# EAGLE design lfsr-display (EAGLE 8.4.3)
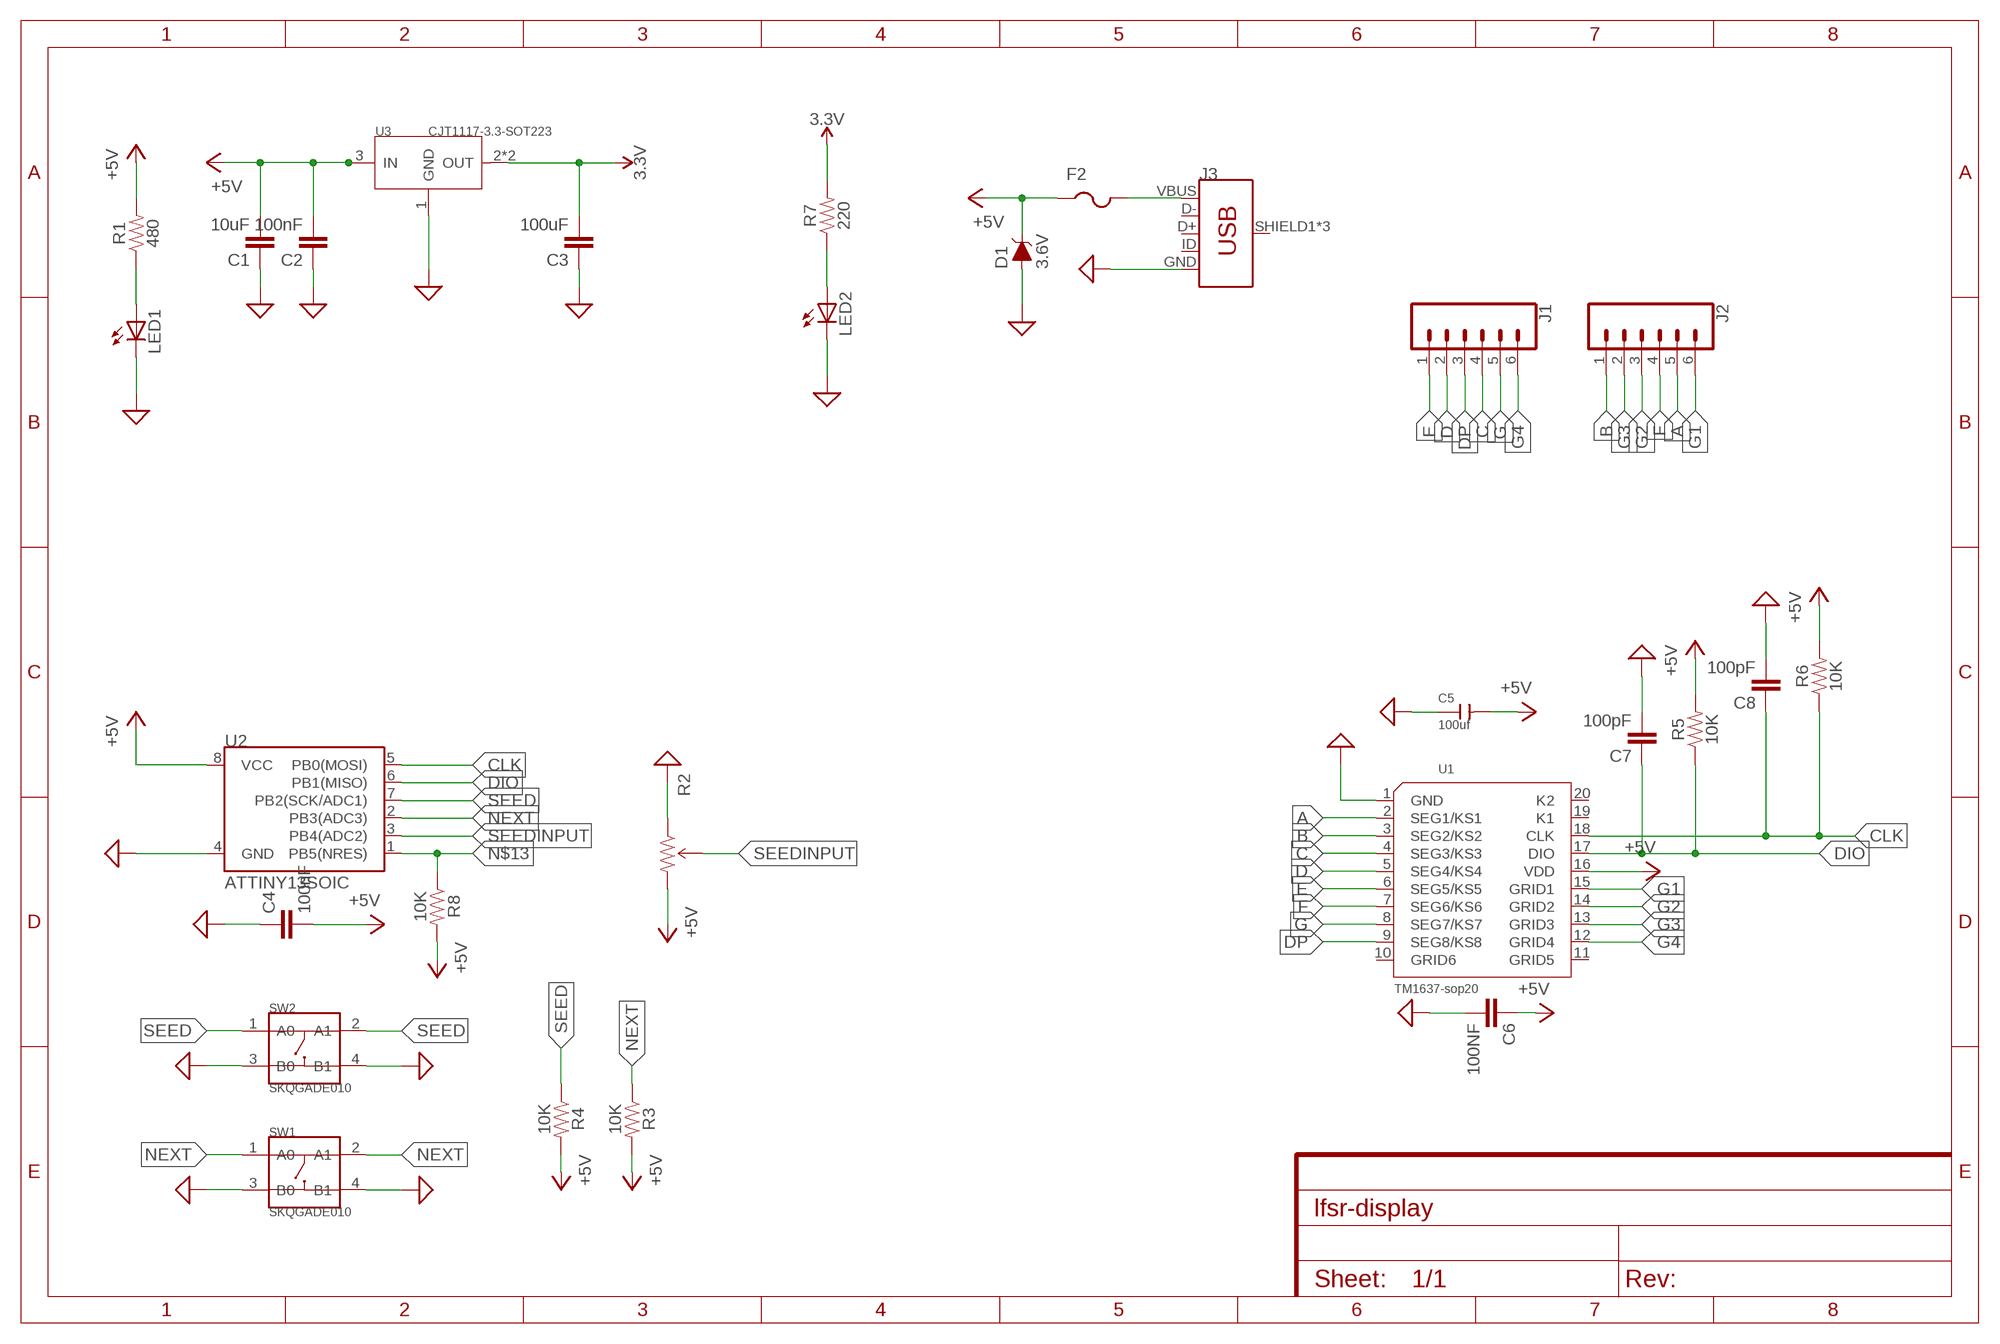
[diagram p0: schematic, sheet 1]

## Parts
C1  10uF  CAPACITOR_0603_L  [RESC0603_L]
C2  100nF  CAPACITOR_0603_L  [RESC0603_L]
C3  100uF  CAPACITOR_0603_L  [RESC0603_L]
C4  100nF  CAPACITOR_0603_L  [RESC0603_L]
C5  100uf  CERAMIC-100UF-6.3V-20%-X5R(1206)  [C1206]
C6  100NF  CAPACITOR_0603_L  [RESC0603_L]
C7  100pF  CAPACITOR_0603_L  [RESC0603_L]
C8  100pF  CAPACITOR_0603_L  [RESC0603_L]
D1  3.6V  DIODE-ZENER-BZT52C3V6S  [SOD-323]
F2  PTCFUSE-1206  [R1206]
J1  CONN_06NO_SILK_FEMALE_PTH  [1X06_NO_SILK]
J2  CONN_06NO_SILK_FEMALE_PTH  [1X06_NO_SILK]
J3  USB_MICRO-BREDUCED_PASTE  [USB-B-MICRO-SMD_RED_PASTE]
LED1  LEDCHIP-LED0603  [CHIP-LED0603]
LED2  LEDCHIP-LED0603  [CHIP-LED0603]
R1  480  0.05OHM-0603-1/5W-1%  [0603]
R2  TRIMPOT  [TRIMPOT-5MM-V2]
R3  10K  0.05OHM-0603-1/5W-1%  [0603]
R4  10K  0.05OHM-0603-1/5W-1%  [0603]
R5  10K  0.05OHM-0603-1/5W-1%  [0603]
R6  10K  0.05OHM-0603-1/5W-1%  [0603]
R7  220  0.05OHM-0603-1/5W-1%  [0603]
R8  10K  0.05OHM-0603-1/5W-1%  [0603]
SW1  SKQGADE010  SMD-BUTTON(4P-5.2X5.2X1.5MM-SKQGADE010)-SKQGADE010  [SW4-SMD-5.2X5.2X1.5MM]
SW2  SKQGADE010  SMD-BUTTON(4P-5.2X5.2X1.5MM-SKQGADE010)-SKQGADE010  [SW4-SMD-5.2X5.2X1.5MM]
U1  TM1637-sop20  DRIVER-TM1637(SOP20)  [SOP20-1.27-12.7X7.65MM]
U2  ATTINY13SOIC  [SO08_MCU]
U3  CJT1117-3.3-SOT223  PMIC-CJT1117-3.3(SOT223)  [SOT-223]

## Nets
3.3V: C3.2 R7.2 U3.2(OUT) U3.TER(OUT)
+5V: C1.2 C2.2 C4.2 C5.2 C6.1 D1.C F2.1 R1.2 R2.C(CW) R3.2 R4.2 R5.2 R6.2 R8.2 U1.16(VDD) U2.8(VCC) U3.3(IN)
A: J2.5 U1.2(SEG1/KS1)
B: J2.1 U1.3(SEG2/KS2)
C: J1.4 U1.4(SEG3/KS3)
CLK: C8.1 R6.1 U1.18(CLK) U2.5(PB0(MOSI))
D: J1.2 U1.5(SEG4/KS4)
DIO: C7.1 R5.1 U1.17(DIO) U2.6(PB1(MISO))
DP: J1.3 U1.9(SEG8/KS8)
E: J1.1 U1.6(SEG5/KS5)
F: J2.4 U1.7(SEG6/KS6)
G: J1.5 U1.8(SEG7/KS7)
G1: J2.6 U1.15(GRID1)
G2: J2.3 U1.14(GRID2)
G3: J2.2 U1.13(GRID3)
G4: J1.6 U1.12(GRID4)
GND: C1.1 C2.1 C3.1 C4.1 C5.1 C6.2 C7.2 C8.2 D1.A J3.GND LED1.C LED2.C R2.A(CCW) SW1.3(B0) SW1.4(B1) SW2.3(B0) SW2.4(B1) U1.1(GND) U2.4(GND) U3.1(GND) ; supply symbol labelled SUP
N$1: LED1.A R1.1
N$4: LED2.A R7.1
N$6: F2.2 J3.VBUS
N$13: R8.1 U2.1(PB5(NRES))
NEXT: R3.1 SW1.1(A0) SW1.2(A1) U2.2(PB3(ADC3))
SEED: R4.1 SW2.1(A0) SW2.2(A1) U2.7(PB2(SCK/ADC1))
SEEDINPUT: R2.B(WIPER) U2.3(PB4(ADC2))
Unconnected: J3.D+ J3.D- J3.ID J3.SHIELD1(SHIELD) J3.SHIELD2(SHIELD) J3.SHIELD3(SHIELD) U1.10(GRID6) U1.11(GRID5) U1.19(K1) U1.20(K2)

## Library data of the parts
C1-C4 C6-C8 = Nordic_nRF:CAPACITOR: Generic chip capacitor
C5 = Seeed-Capacitor:CERAMIC-100UF-6.3V-20%-X5R(1206): 302010183; MPN: GRM31CR60J107ME39L
D1 = SparkFun-DiscreteSemi:DIODE-ZENER: Zener Diode A Zener diode allows current to flow from its anode to its cathode like a normal semiconductor diode, but it also permits current to flow in the reverse direction when its "Zener voltage" is reached. - WIkipedia; PROD_ID: DIO-08199
F2 = adafruit:PTCFUSE: PTC fuses, resettable thermistors
J1 J2 = SparkFun-Connectors:CONN_06: Multi connection point. Often used as Generic Header-pin footprint for 0.1 inch spaced/style header connections On any of the 0.1 inch spaced packages, you can populate with these: Break Away Headers - Straight <https://www.sparkfun.com/products/116> (PRT-00116) Break Away Male Headers - Right Angle <https://www.sparkfun.com/products/553> (PRT-00553) Female Headers <https://www.sparkfun.com/products/115> (PRT-00115) Break Away Headers - Machine Pin <https://www.sparkfun.com/products/117> (PRT-00117) Break Away Female Headers - Swiss Machine Pin <https://www.sparkfun.com/products/743> (PRT-00743) Arduino Stackable Header - 6 Pin <https://www.sparkfun.com/products/9280> (PRT-09280) For SCREWTERMINALS and SPRING TERMINALS visit here: Screw Terimnals on SparkFun.com <https://www.sparkfun.com/search/results?term=Screw+Terminals> (5mm/3.5mm/2.54mm spacing) This device is also useful as a general connection point to wire up your design to another part of your project. Our various solder wires solder well into these plated through hole pads. Hook-Up Wire - Assortment (Stranded, 22 AWG) <https://www.sparkfun.com/products/11375> (PRT-11375) Hook-Up Wire - Assortment (Solid Core, 22 AWG) <https://www.sparkfun.com/products/11367> (PRT-11367) View the entire wire category on our website here <https://www.sparkfun.com/categories/141>; PROD_ID: CONN-08437
J3 = SparkFun-Connectors:USB_MICRO-B: USB Type Micro-B Connector Male/female and PTH/SMT variants SparkFun Products: SparkFun microB USB Breakout <https://www.sparkfun.com/products/12035> SparkFun USB microB Plug Breakout <https://www.sparkfun.com/products/10031> SparkFun ESP8266 Thing <https://www.sparkfun.com/products/13231>; PROD_ID: CONN-11752
LED1 LED2 = led:LED: LED OSRAM: - CHIPLED LG R971, LG N971, LY N971, LG Q971, LY Q971, LO R971, LY R971 LH N974, LH R974 LS Q976, LO Q976, LY Q976 LO Q996 - Hyper CHIPLED LW Q18S LB Q993, LB Q99A, LB R99A - SideLED LS A670, LO A670, LY A670, LG A670, LP A670 LB A673, LV A673, LT A673, LW A673 LH A674 LY A675 LS A676, LA A676, LO A676, LY A676, LW A676 LS A679, LY A679, LG A679 - Hyper Micro SIDELED® LS Y876, LA Y876, LO Y876, LY Y876 LT Y87S - SmartLED LW L88C, LW L88S LB L89C, LB L89S, LG L890 LS L89K, LO L89K, LY L89K LS L896, LA L896, LO L896, LY L896 - TOPLED LS T670, LO T670, LY T670, LG T670, LP T670 LSG T670, LSP T670, LSY T670, LOP T670, LYG T670 LG T671, LOG T671, LSG T671 LB T673, LV T673, LT T673, LW T673 LH T674 LS T676, LA T676, LO T676, LY T676, LB T676, LH T676, LSB T676, LW T676 LB T67C, LV T67C, LT T67C, LS T67K, LO T67K, LY T67K, LW E67C LS E67B, LA E67B, LO E67B, LY E67B, LB E67C, LV E67C, LT E67C LW T67C LS T679, LY T679, LG T679 LS T770, LO T770, LY T770, LG T770, LP T770 LB T773, LV T773, LT T773, LW T773 LH T774 LS E675, LA E675, LY E675, LS T675 LS T776, LA T776, LO T776, LY T776, LB T776 LHGB T686 LT T68C, LB T68C - Hyper Mini TOPLED® LB M676 - Mini TOPLED Santana® LG M470 LS M47K, LO M47K, LY M47K Source: http://www.osram.convergy.de LUXEON: - LUMILED® LXK2-PW12-R00, LXK2-PW12-S00, LXK2-PW14-U00, LXK2-PW14-V00 LXK2-PM12-R00, LXK2-PM12-S00, LXK2-PM14-U00 LXK2-PE12-Q00, LXK2-PE12-R00, LXK2-PE12-S00, LXK2-PE14-T00, LXK2-PE14-U00 LXK2-PB12-K00, LXK2-PB12-L00, LXK2-PB12-M00, LXK2-PB14-N00, LXK2-PB14-P00, LXK2-PB14-Q00 LXK2-PR12-L00, LXK2-PR12-M00, LXK2-PR14-Q00, LXK2-PR14-R00 LXK2-PD12-Q00, LXK2-PD12-R00, LXK2-PD12-S00 LXK2-PH12-R00, LXK2-PH12-S00 LXK2-PL12-P00, LXK2-PL12-Q00, LXK2-PL12-R00 Source: www.luxeon.com KINGBRIGHT: KA-3528ASYC Source: www.kingbright.com
R1 R3-R8 = SparkFun-Resistors:0.05OHM: 0.05Ω resistor A resistor is a passive two-terminal electrical component that implements electrical resistance as a circuit element. Resistors act to reduce current flow, and, at the same time, act to lower voltage levels within circuits. - Wikipedia; PROD_ID: RES-12535; VALUE: 0.05
R2 = SparkFun-Retired:TRIMPOT: Various small potentiometers for "set-and-forget" applications
SW1 SW2 = Seeed-Switch:SMD-BUTTON(4P-5.2X5.2X1.5MM-SKQGADE010): 311020017; MPN: SKQGADE010
U1 = Seeed-IC:DRIVER-TM1637(SOP20): 310040027; MPN: TM1637
U2 = SparkFun-Retired:ATTINY13: ATTINY13 Retired
U3 = Seeed-IC:PMIC-CJT1117-3.3(SOT223): 310030097; MPN: CJT1117-3.3

## Board
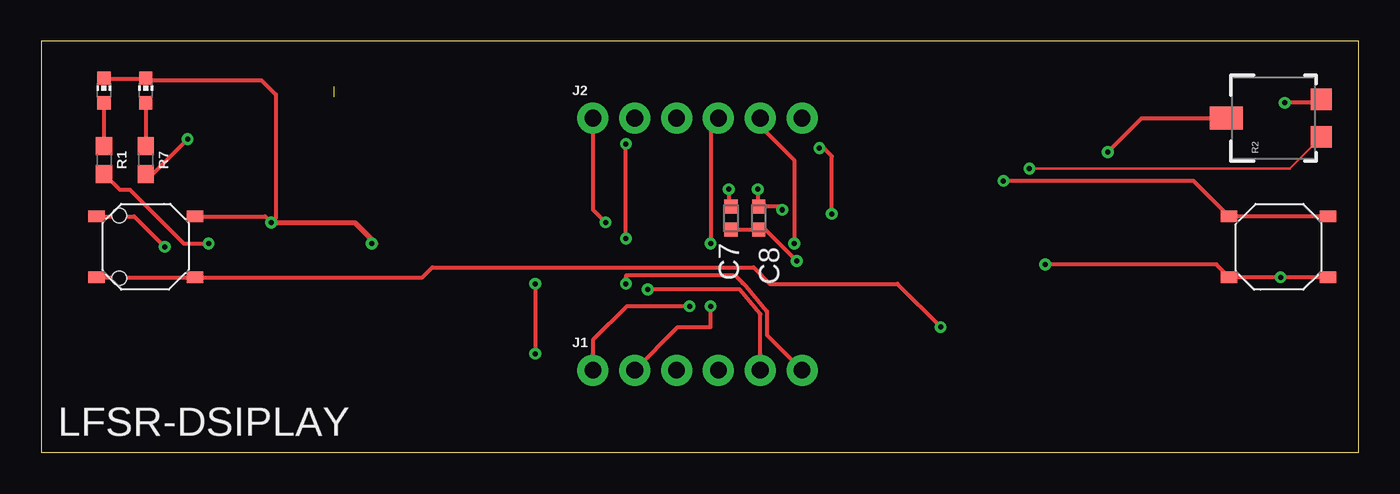
[diagram p1: board, top side]
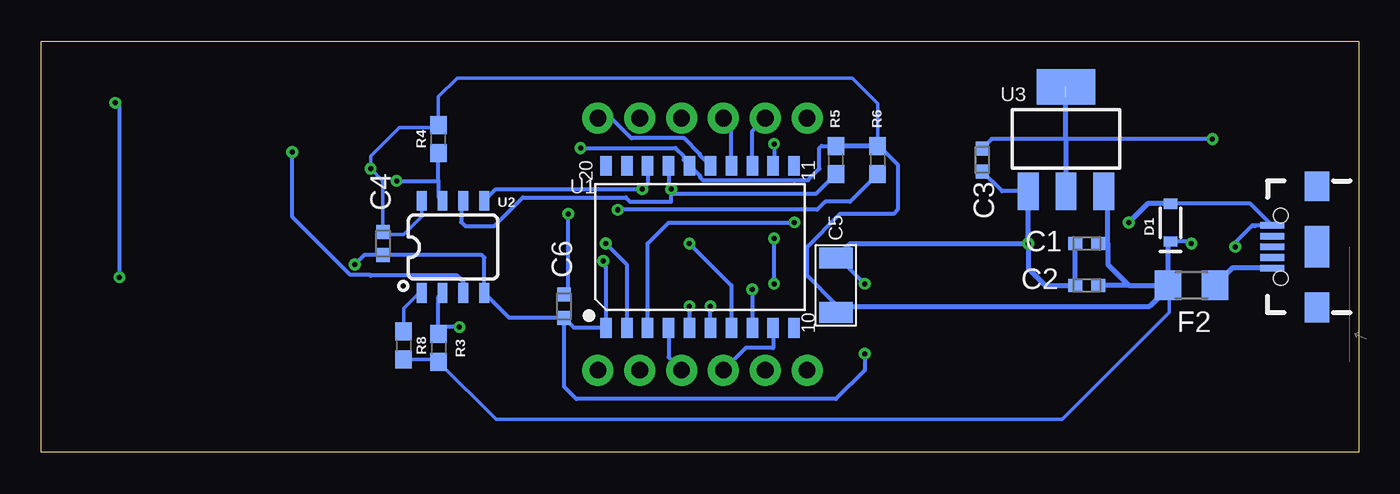
[diagram p2: board, bottom side, seen from below]

Size 80 x 25 mm. Coordinates in mm from the lower left corner, seen from the top.
Outline: 0,0 80,0 80,25 0,25 0,0
Copper layers (1*16): Top 0.035mm / dielectric 1.5mm / Bottom 0.035mm
Design rules "default *": minimum track width 6mil, minimum drill 0.35mm, track to track 6mil, track to pad 6mil, pad to pad 6mil, via to via 6mil, smd to smd 6mil, copper to edge 40mil, drill to drill 6mil, minimum pad ring 10mil, minimum via ring 8mil, stop-mask expansion 4mil, vias tented up to drill 15mil, thermal gap 10mil

### Footprints (pad centres in the part's own frame; a part is rotated, then mirrored left to right if it is on the bottom)
RESC0603_L = smd 0.85 x 0.8: 1 -0.7,0; 2 0.7,0
C1206 = smd 1.27 x 2.032: 1 -1.651,0; 2 1.651,0
SOD-323 = smd 0.63 x 0.83: A 1.15,0; C -1.15,0
R1206 = smd 1.6 x 1.803: 1 -1.422,0; 2 1.422,0
1X06_NO_SILK = drill 1.016 pad 1.88: 1 0,0; 2 2.54,0; 3 5.08,0; 4 7.62,0; 5 10.16,0; 6 12.7,0
USB-B-MICRO-SMD_RED_PASTE = smd 1.45 x 0.4: D+ 2.725,0; D- 2.725,0.65; GND 2.725,-1.3; ID 2.725,-0.65; VBUS 2.725,1.3 | smd 1.5 x 1.8: SHIELD1 0,3.685; SHIELD2 0,-3.685 | smd 1.5 x 2.5: SHIELD3 0,0 | hole 0.85: 2.2,1.9; 2.2,-1.9
CHIP-LED0603 = smd 0.8 x 0.8: A 0,-0.75; C 0,0.75
0603 = smd 1.1 x 1: 1 -0.85,0; 2 0.85,0
TRIMPOT-5MM-V2 = smd 1.3 x 1.3: A 1.15,-2.54; C -1.15,-2.54 | smd 1.402 x 2: B 0,3.239
SW4-SMD-5.2X5.2X1.5MM = smd 1 x 0.7: 1 -3,1.85; 2 3,1.85; 3 -3,-1.85; 4 3,-1.85
SOP20-1.27-12.7X7.65MM = smd 0.7 x 1.2: 1 -5.715,-4.925; 2 -4.445,-4.925; 3 -3.175,-4.925; 4 -1.905,-4.925; 5 -0.635,-4.925; 6 0.635,-4.925; 7 1.905,-4.925; 8 3.175,-4.925; 9 4.445,-4.925; 10 5.715,-4.925; 11 5.715,4.925; 12 4.445,4.925; 13 3.175,4.925; 14 1.905,4.925; 15 0.635,4.925; 16 -0.635,4.925; 17 -1.905,4.925; 18 -3.175,4.925; 19 -4.445,4.925; 20 -5.715,4.925
SO08_MCU = smd 0.6 x 1.2: 1 -1.905,-2.8; 2 -0.635,-2.8; 3 0.635,-2.8; 4 1.905,-2.8; 5 1.905,2.8; 6 0.635,2.8; 7 -0.635,2.8; 8 -1.905,2.8
SOT-223 = smd 1.27 x 2.286: 1 -2.286,-3.175; 2 0,-3.175; 3 2.286,-3.175 | smd 3.556 x 2.159: TER 0,3.175

### Placement (x,y rotation side)
C1  16.51,12.7 0 bottom
C2  16.51,10.16 0 bottom
C3  22.86,17.78 90 bottom
C4  59.25,12.7 90 bottom
C5  31.75,10.16 270 bottom
C6  48.26,8.89 270 bottom
C7  41.88,14.24 270 top
C8  43.57,14.24 270 top
D1  11.43,13.97 90 bottom
F2  10.16,10.16 0 bottom
J1  33.5,5 0 top
J2  33.5,20.32 0 top
J3  2.54,12.5 180 bottom
LED1  3.81,22 0 top
LED2  6.35,22 0 top
R1  3.81,17.78 270 top
R2  75.18,20.32 90 top
R3  55.88,6.35 270 bottom
R4  55.88,19.05 90 bottom
R5  31.75,17.78 90 bottom
R6  29.21,17.78 90 bottom
R7  6.35,17.78 270 top
R8  58,6.5 270 bottom
SW1  6.35,12.5 180 top
SW2  75.13,12.5 0 top
U1  40,12.5 0 bottom
U2  55,12.5 0 bottom
U3  17.78,19.05 0 bottom

### Tracks (layer width: path | path; a pad name or v marks a point on that pad's centre or on a via)
3.3V  (via drill 0.3)  (1 unrouted)
  Top 0.254: R7.2 6.77,16.93 v8.89,19.05
  Bottom 0.254: C3.2 22.29,19.05 17.78,19.05 v8.89,19.05
  Bottom 0.305: U3.2 17.78,19.05 17.78,21.59
+5V  (via drill 0.3)
  Top 0.152: R2.C 75.8,17.25 v60,17.25
  Top 0.254: R1.2 4.77,15.97 5.39,15.97 8.66,12.7 v10.16,12.7 | v48,14.5 48,18 47.5,18.5 v47.25,18.5
  Bottom 0.152: R4.2 55.88,20 55.88,21.5
  Bottom 0.203: U2.8 56.91,14.35 58,13.25 59.1,13.25 C4.2 59.25,16.5 v60,17.25 60,18 58.25,19.75 56.13,19.75 55.88,20 | R4.2 55.88,21.5 55.88,21.62 54.75,22.75 30.75,22.75 29.21,21.21 R6.2 | 11.58,10.01 11.5,9.93 11.5,8.5 18,2 52.38,2 R3.2 56.03,5.65 R8.2
  Bottom 0.254: v10.16,12.7 10.28,12.82 D1.C | C5.2 31.75,9 33.5,10.75 33.5,12.5 31.5,14.5 28.25,14.5 28,14.75 28,17.5 29.13,18.63 R6.2 | 34.3,16.55 34.25,16.5 | 34.3,16.55 39.83,16.55 39.99,16.71 39.99,16.78 U1.16 41,17.79 41,18 41.5,18.5 v47.25,18.5 | 34.3,16.55 33.45,16.55 32.75,17.25 32.75,18.5 32.62,18.63 R5.2 | C6.1 48,9.85 v48,14.5
  Bottom 0.305: F2.1 11.58,12.67 D1.C | U3.3 15.24,15.62 15.24,12.7 | 15.24,12.7 15.24,11.43 13.97,10.16 | 13.97,10.16 F2.1 | 13.97,10.16 C2.2 | C1.2 15.24,12.7 | C5.2 31.37,8.89 12.7,8.89 11.58,10.01 F2.1 | R6.2 R5.2
A  (via drill 0.3)
  Top 0.254: J2.5 43.66,19.84 45.72,17.78 v45.72,12.7
  Bottom 0.254: v45.72,12.7 44.45,11.43 U1.2
B  (via drill 0.3)
  Top 0.254: J2.1 33.5,14.76 v34.27,13.99
  Bottom 0.254: U1.3 43.17,12.71 41.91,13.97 34.29,13.97 v34.27,13.99
C
  Bottom 0.254: U1.4 41.91,5.79 J1.4
CLK  (via drill 0.3)
  Top 0.254: v43.5,16 43.5,15.01 C8.1 44.81,14.94 v45,14.75
  Bottom 0.254: U1.18 43.17,16.32 v43.5,16 52.4,16 U2.5 | R6.1 30.89,15.25 32.38,15.25 32.88,14.75 v45,14.75
D  (via drill 0.3)
  Top 0.254: J1.2 38.66,7.62 40.64,7.62 v40.64,8.89
  Bottom 0.254: v40.64,8.89 U1.5
DIO  (via drill 0.3)
  Top 0.254: v41.75,16 41.75,15.07 C7.1
  Bottom 0.254: U1.17 41.91,16.16 v41.75,16 41.75,15.75 | U2.6 54.5,15.16 54.5,14 54.25,13.75 52.5,13.75 50.75,15.5 44.5,15.5 44.25,15.25 41.75,15.25 41.75,15.75 | R5.1 32.93,15.75 41.75,15.75
DP
  Bottom 0.254: U1.9 35.55,6.36 35.56,6.35 37.23,6.35 J1.3
E  (via drill 0.3)
  Top 0.254: J1.1 33.5,6.83 35.56,8.89 v39.37,8.89
  Bottom 0.254: U1.6 v39.37,8.89
F  (via drill 0.3)
  Top 0.254: J2.4 40.64,19.84 v40.64,12.7
  Bottom 0.254: U1.7 38.09,10.15 v40.64,12.7
G  (via drill 0.3)
  Top 0.254: J1.5 43.66,8.41 42.41,9.91 v36.83,9.91
  Bottom 0.254: v36.83,9.91 U1.8
G1
  Bottom 0.254: U1.15 40.01,18.07 40.01,18.14 40.97,19.1 44.16,19.1 45.38,20.32 J2.6
G2
  Bottom 0.254: U1.14 38.09,19.84 J2.3
G3
  Bottom 0.254: U1.13 36.83,19.54 J2.2
G4  (via drill 0.3)
  Top 0.254: J1.6 44.08,7.12 44.08,8.56 44.07,8.58 42.82,10.08 42.71,10.18 42.61,10.3 42.59,10.3 42.16,10.74 42.01,10.75 35.5,10.75 v35.5,10.25 | v35.5,13 v35.5,18.75
  Bottom 0.254: v35.5,10.25 v35.5,13 | v35.5,18.75 35.5,17.48 U1.12
GND  (via drill 0.3)
  Top 0.254: SW2.4 v75.25,10.65 SW2.3 71.35,11.43 v60.96,11.43 | SW1.3 13.59,14.35 v13.97,13.97 14.25,14.25 14.25,21.75 13.38,22.62 6.47,22.62 LED2.C 6,22.73 3.83,22.73 LED1.C | C7.2 C8.2 43.96,13.54 45.75,11.75 v45.88,11.63 | v30,10.25 v30,6 30,5.75 | R2.A 77.5,21.25 v75.5,21.25 | SW1.4 5.65,14.35 v7.5,12.5
  Top 0.305: v13.97,13.97 19.05,13.97 20.32,12.7 v20.07,12.7
  Bottom 0.254: D1.A 6.58,15.12 J3.GND 6.45,13.8 6.5,13.75 | U3.1 21.66,15.88 C3.1 | v60.96,11.43 60.39,12 C4.1 53.25,12 53.09,11.85 U2.4 51.59,8.19 C6.2 | C6.2 47.65,7.58 U1.1 45.72,11.21 45.75,11.5 45.75,11.26 v45.88,11.63 | C5.1 31.56,11.81 v30,10.25 | v30,6 30,5 31.75,3.25 47.5,3.25 48.25,4 C6.2 | v75.5,21.25 75.25,21 v75.25,10.65 | v7.5,12.5 7.5,12.75 6.5,13.75 | 6.31,13.75 6.5,13.75
  Bottom 0.305: v20.07,12.7 U3.1 | v20.07,12.7 20.07,11.18 19.05,10.16 C2.1 C1.1 | D1.A 12.82,15.12 v13.97,13.97 | C5.1 30.86,12.7 v20.07,12.7
N$1
  Top 0.254: LED1.A R1.1
N$4
  Top 0.254: LED2.A R7.1
N$6
  Bottom 0.305: J3.VBUS 7.7,11.2 F2.2
N$13
  Bottom 0.203: R8.1 58,8.75 57.05,9.7 U2.1
NEXT  (via drill 0.3)
  Top 0.254: SW1.2 SW1.1 23.15,10.65 23.75,11.25 43.25,11.25 44.25,10.25 51.98,10.25 v54.61,7.62
  Bottom 0.254: U2.2 55.88,9.46 55.88,7.62 | 55.88,7.62 R3.1 | v54.61,7.62 55.88,7.62
SEED  (via drill 0.3)
  Top 0.254: SW2.2 SW2.1 69.97,16.51 v58.42,16.51
  Bottom 0.254: U2.7 55.88,15.54 55.88,16.51 | 55.88,16.51 R4.1 | v58.42,16.51 55.88,16.51
SEEDINPUT  (via drill 0.3)
  Top 0.254: v64.75,18.25 66.82,20.32 R2.B
  Bottom 0.254: U2.3 54.37,10.37 54.75,10.75 60,10.75 60.05,10.79 61.22,10.79 64.75,14.32 v64.75,18.25

### Text on the board
tPlace: LFSR-DSIPLAY